# EAGLE schematic reflow_oven (EAGLE 6.1)
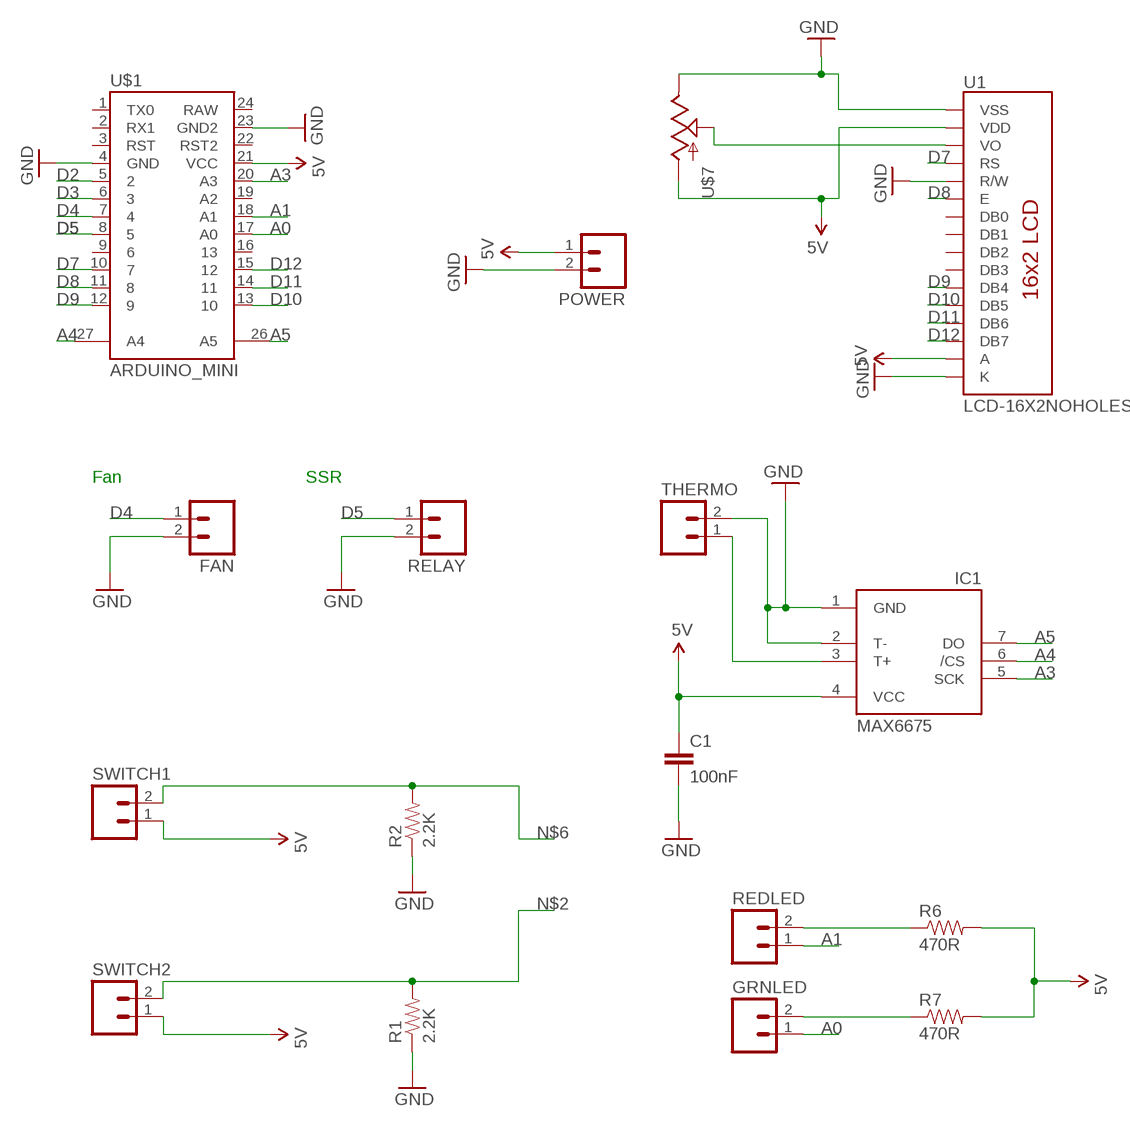
[diagram p0: schematic, sheet 1]

## Parts
C1  100nF  CAP0805  [0805]
FAN  M02PTH3  [1X02_LONGPADS]
GRNLED  M021X02_NO_SILK  [1X02_NO_SILK]
IC1  MAX6675  [SO08]
POWER  M02PTH3  [1X02_LONGPADS]
R1  2.2K  RESISTOR0805-RES  [0805]
R2  2.2K  RESISTOR0805-RES  [0805]
R6  470R  RESISTOR0805-RES  [0805]
R7  470R  RESISTOR0805-RES  [0805]
REDLED  M021X02_NO_SILK  [1X02_NO_SILK]
RELAY  M02PTH3  [1X02_LONGPADS]
SWITCH1  M02PTH3  [1X02_LONGPADS]
SWITCH2  M02PTH3  [1X02_LONGPADS]
THERMO  M02PTH3  [1X02_LONGPADS]
U1  LCD-16X2NOHOLES  [LCD-16X2_NOHOLES]
U$1  ARDUINO_MINI  [ARDUINO_MINI]
U$7  POT-RV16AF-20  [POT_ALPHA_RV16AF-20]

## Nets
5V: C1.1 IC1.4(VCC) POWER.1 R6.2 R7.2 SWITCH1.1 SWITCH2.1 U1.2(VDD) U1.15(A) U$1.21(VCC) U$7.1(A)
A0: GRNLED.1 U$1.17(A0)
A1: REDLED.1 U$1.18(A1)
A3: IC1.5(SCK) U$1.20(A3)
A4: IC1.6(/CS) U$1.27(A4)
A5: IC1.7(DO) U$1.26(A5)
D2: U$1.5
D3: U$1.6
D4: FAN.1 U$1.7
D5: RELAY.1 U$1.8
D7: U1.4(RS) U$1.10
D8: U1.6(E) U$1.11
D9: U1.11(DB4) U$1.12
D10: U1.12(DB5) U$1.13
D11: U1.13(DB6) U$1.14
D12: U1.14(DB7) U$1.15
GND: C1.2 FAN.2 IC1.1(GND) IC1.2(T-) POWER.2 R1.1 R2.1 RELAY.2 THERMO.2 U1.1(VSS) U1.5(R/W) U1.16(K) U$1.4(GND) U$1.23(GND2) U$7.3(E)
N$1: U1.3(VO) U$7.2(S)
N$2: R1.2 SWITCH2.2
N$3: IC1.3(T+) THERMO.1
N$4: R6.1 REDLED.2
N$5: GRNLED.2 R7.1
N$6: R2.2 SWITCH1.2
Unconnected: U1.7(DB0) U1.8(DB1) U1.9(DB2) U1.10(DB3) U$1.1(TX0) U$1.2(RX1) U$1.3(RST) U$1.9 U$1.16 U$1.19(A2) U$1.22(RST2) U$1.24(RAW)

## Notes on the sheet
- Fan | SSR

## Library data of the parts
C1 = SparkFun:CAP: Capacitor Standard 0603 ceramic capacitor, and 0.1" leaded capacitor.
FAN GRNLED POWER REDLED RELAY SWITCH1 SWITCH2 THERMO = SparkFun:M02: Header 2 Standard 2-pin 0.1" header. Use with straight break away headers (SKU : PRT-00116), right angle break away headers (PRT-00553), swiss pins (PRT-00743), machine pins (PRT-00117), and female headers (PRT-00115). Molex polarized connector foot print use with SKU : PRT-08233 with associated crimp pins and housings.
IC1 = adafruit:MAX6675
R1 R2 R6 R7 = SparkFun:RESISTOR: Resistor Basic schematic elements and footprints for 0603, 1206, and PTH resistors.
U1 = SparkFun:LCD-16X2
U$1 = SparkFun:ARDUINO_MINI
U$7 = SparkFun:POT